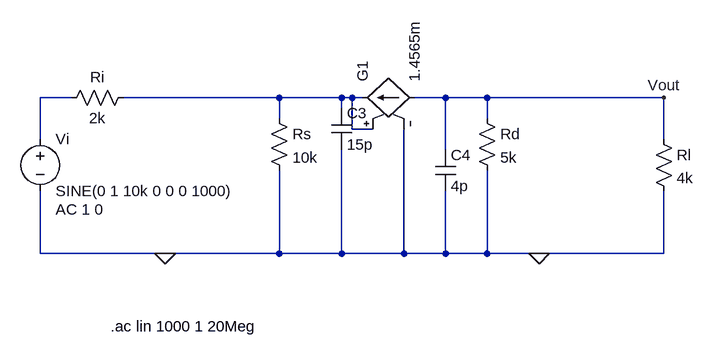
[diagram p0: schematic Draft3.asc]
Draft3.asc, the LTspice schematic file:
Version 4
SHEET 1 880 680
WIRE -304 192 -352 192
WIRE 16 192 -224 192
WIRE 112 192 16 192
WIRE 128 192 112 192
WIRE 144 192 128 192
WIRE 272 192 224 192
WIRE 336 192 272 192
WIRE 608 192 336 192
WIRE 112 208 112 192
WIRE 16 224 16 192
WIRE 336 224 336 192
WIRE 128 240 128 192
WIRE 160 240 128 240
WIRE -352 256 -352 192
WIRE 608 256 608 192
WIRE 272 272 272 192
WIRE -352 432 -352 336
WIRE -160 432 -352 432
WIRE 16 432 16 304
WIRE 16 432 -160 432
WIRE 112 432 112 272
WIRE 112 432 16 432
WIRE 208 432 208 240
WIRE 208 432 112 432
WIRE 272 432 272 336
WIRE 272 432 208 432
WIRE 336 432 336 304
WIRE 336 432 272 432
WIRE 416 432 336 432
WIRE 608 432 608 336
WIRE 608 432 416 432
FLAG -160 432 0
FLAG 416 432 0
FLAG 608 192 Vout
DATAFLAG 16 192 ""
DATAFLAG 320 192 ""
SYMBOL res 0 208 R0
SYMATTR InstName Rs
SYMATTR Value 10k
SYMBOL res 320 208 R0
SYMATTR InstName Rd
SYMATTR Value 5k
SYMBOL res -208 176 R90
WINDOW 0 0 56 VBottom 2
WINDOW 3 32 56 VTop 2
SYMATTR InstName Ri
SYMATTR Value 2k
SYMBOL voltage -352 240 R0
WINDOW 123 24 124 Left 2
WINDOW 39 0 0 Left 0
SYMATTR InstName Vi
SYMATTR Value SINE(0 1 10k 0 0 0 1000)
SYMATTR Value2 AC 1 0
SYMBOL res 592 240 R0
SYMATTR InstName Rl
SYMATTR Value 4k
SYMBOL g 128 192 R270
SYMATTR InstName G1
SYMATTR Value 1.4565m
SYMBOL cap 96 208 R0
SYMATTR InstName C3
SYMATTR Value 15p
SYMBOL cap 256 272 R0
SYMATTR InstName C4
SYMATTR Value 4p
TEXT -244 544 Left 2 !.ac lin 1000 1 20Meg

The netlist it stands for:
* Draft3.asc
Rs N002 0 10k
Rd Vout 0 5k
Ri N002 N001 2k
Vi N001 0 SINE(0 1 10k 0 0 0 1000) AC 1 0
Rl Vout 0 4k
G1 Vout N002 N002 0 1.4565m
C3 N002 0 15p
C4 Vout 0 4p
.ac lin 1000 1 20Meg
.backanno
.end